# Altium schematic sheet IO_ctrl.SchDoc
size A3
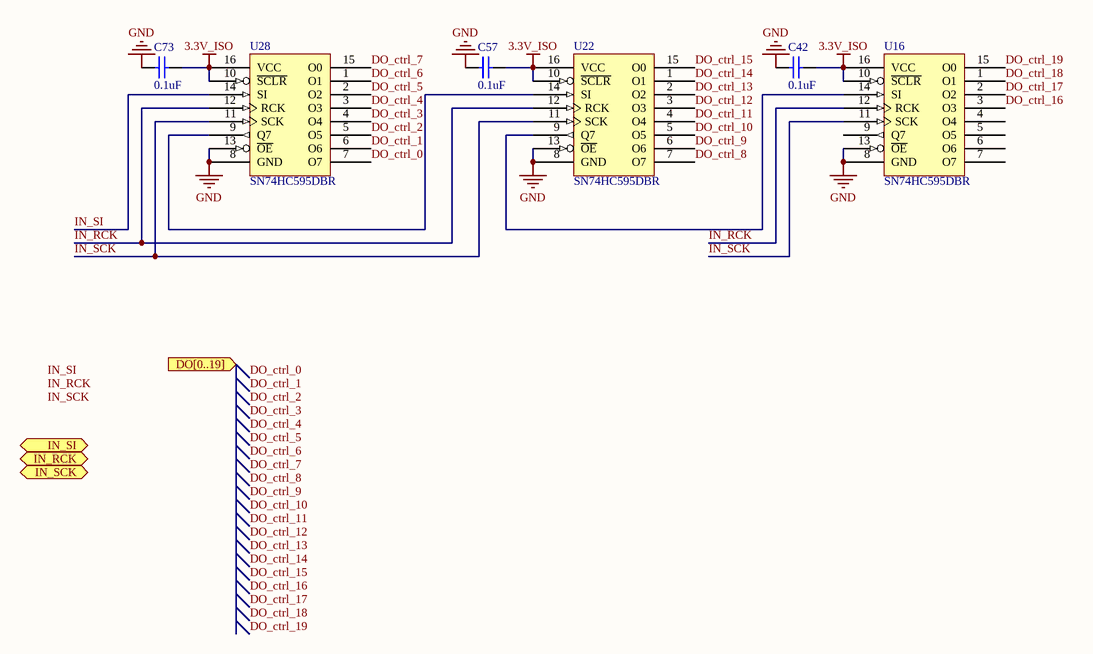
[diagram p0: IO_ctrl.SchDoc]

## Parts
C42  0.1uF  [0603C]
C57  0.1uF  [0603C]
C73  0.1uF  [0603C]
U16  SN74HC595DBR  [SSOP16]
U22  SN74HC595DBR  [SSOP16]
U28  SN74HC595DBR  [SSOP16]

## Ports
DO[0..19] (in), IN_RCK (in), IN_SCK (in), IN_SI (in)

## Nets
3.3V_ISO: C42.1 C57.1 C73.1 U16.10(~{SCLR}) U16.16(VCC) U22.10(~{SCLR}) U22.16(VCC) U28.10(~{SCLR}) U28.16(VCC)
GND: C42.2 C57.2 C73.2 U16.8(GND) U16.13(~{OE}) U22.8(GND) U22.13(~{OE}) U28.8(GND) U28.13(~{OE})
DO_ctrl_0: U28.7(O7)
DO_ctrl_1: U28.6(O6)
DO_ctrl_2: U28.5(O5)
DO_ctrl_3: U28.4(O4)
DO_ctrl_4: U28.3(O3)
DO_ctrl_5: U28.2(O2)
DO_ctrl_6: U28.1(O1)
DO_ctrl_7: U28.15(O0)
DO_ctrl_8: U22.7(O7)
DO_ctrl_9: U22.6(O6)
DO_ctrl_10: U22.5(O5)
DO_ctrl_11: U22.4(O4)
DO_ctrl_12: U22.3(O3)
DO_ctrl_13: U22.2(O2)
DO_ctrl_14: U22.1(O1)
DO_ctrl_15: U22.15(O0)
DO_ctrl_16: U16.3(O3)
DO_ctrl_17: U16.2(O2)
DO_ctrl_18: U16.1(O1)
DO_ctrl_19: U16.15(O0)
IN_RCK: U16.12(RCK) U22.12(RCK) U28.12(RCK)
IN_SCK: U16.11(SCK) U22.11(SCK) U28.11(SCK)
IN_SI: U28.14(SI)
NetU16_14: U16.14(SI) U22.9(Q7)
NetU22_14: U22.14(SI) U28.9(Q7)

Not connected (* = marked no-connect by the designer): U16 4(O4) 5(O5) 6(O6) 7(O7) 9(Q7)

## Notes on the sheet
- Labels drawn without touching a wire or pin: DO_ctrl_0, DO_ctrl_1, DO_ctrl_2, DO_ctrl_3, DO_ctrl_4, DO_ctrl_5, DO_ctrl_6, DO_ctrl_7, DO_ctrl_8, DO_ctrl_9, DO_ctrl_10, DO_ctrl_11, DO_ctrl_12, DO_ctrl_13, DO_ctrl_14, DO_ctrl_15, DO_ctrl_16, DO_ctrl_17, DO_ctrl_18, DO_ctrl_19, IN_RCK, IN_SCK, IN_SI

## Library data of the parts
C42 C57 C73 = Cap: Capacitor; Published: 8-Jun-2000; LatestRevisionDate: 17-Jul-2002; LatestRevisionNote: Re-released for DXP Platform.; PackageReference: RAD-0.3; Publisher: Altium Limited; PackageDescription: Radial Cap, Thru-Hole; 2 Leads; 0.3 in Pin Spacing; Value: 0.1uF
U16 U22 U28 = 74HC595